# EAGLE design NAU7802 (EAGLE 9.6.2)
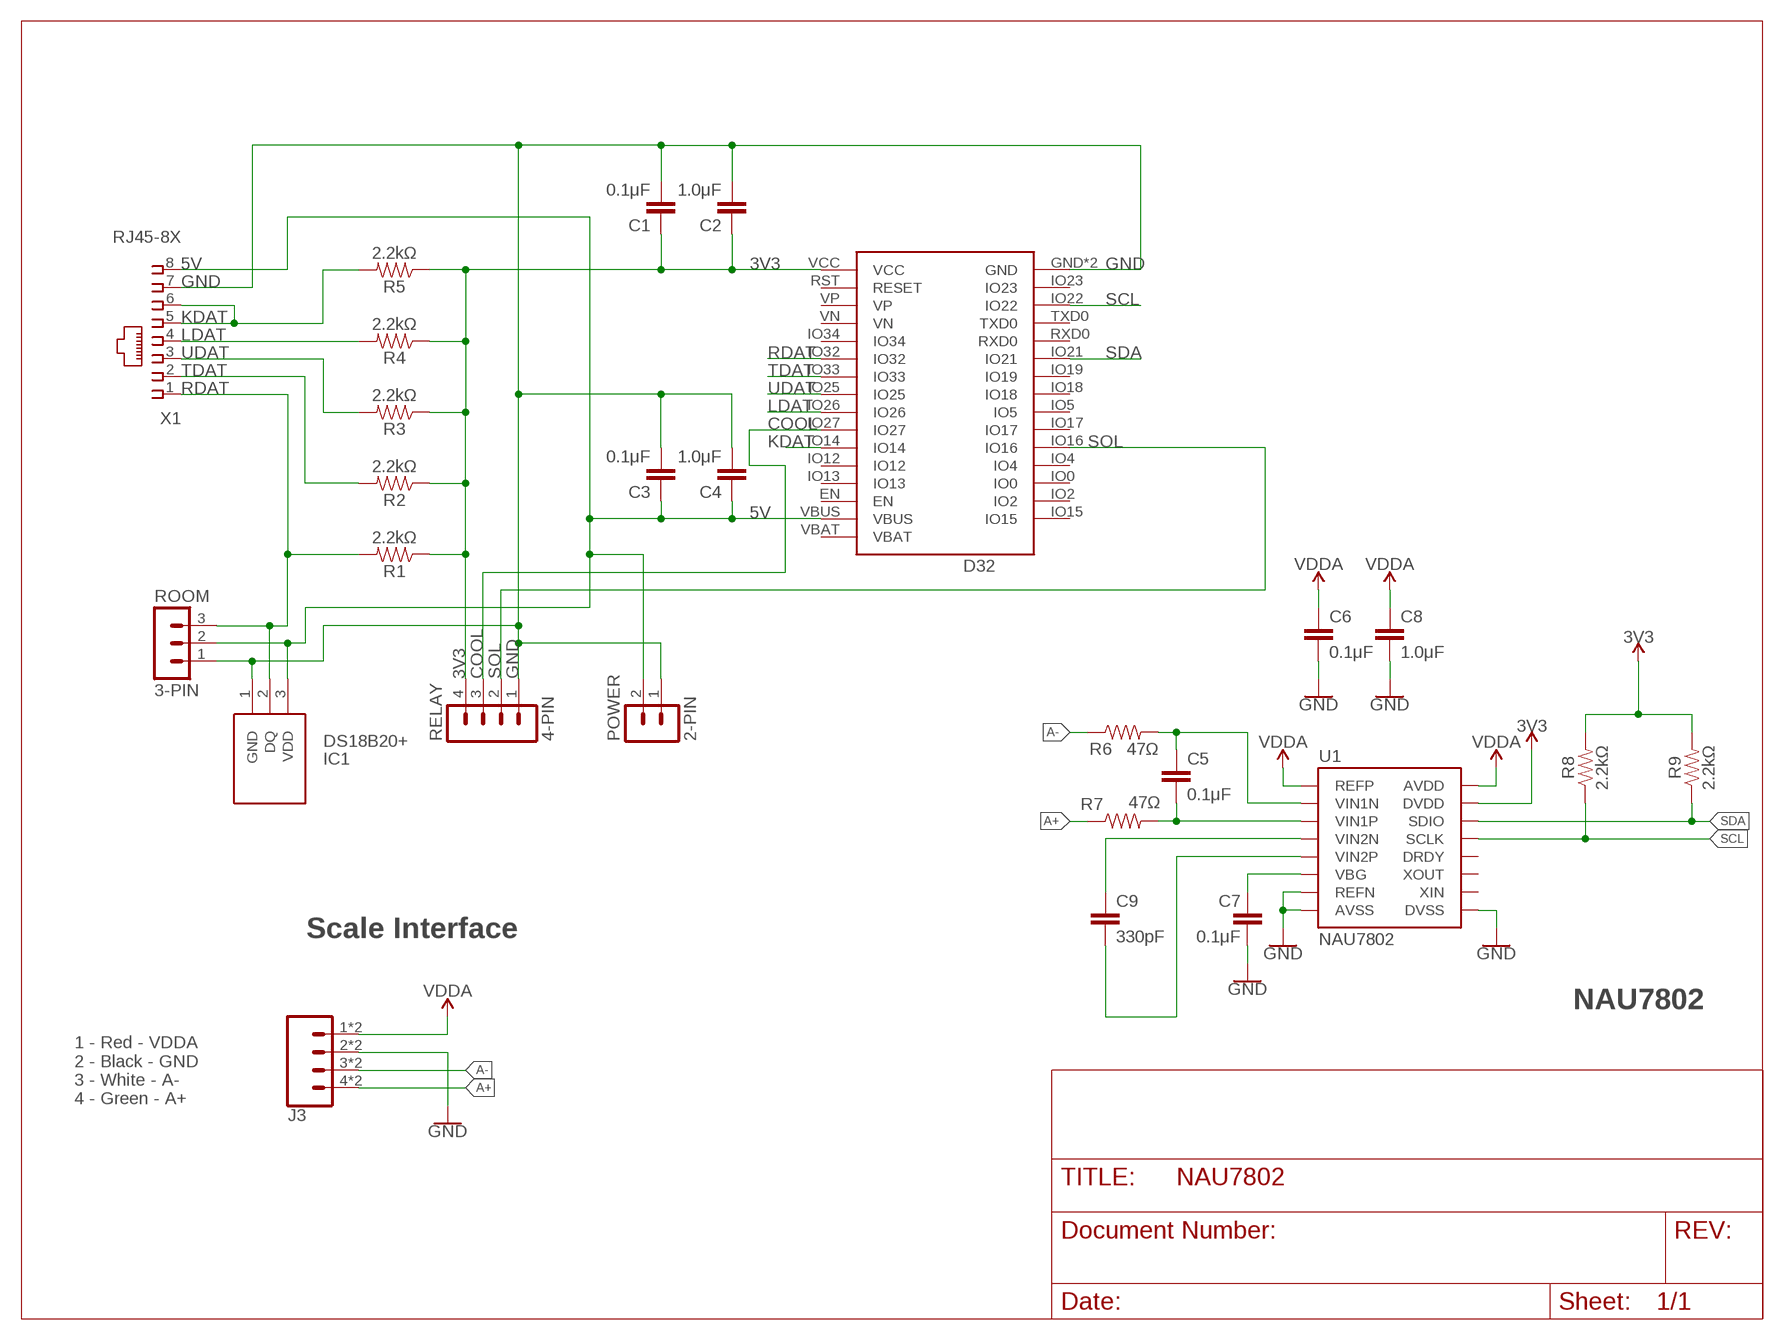
[diagram p0: schematic, sheet 1]

## Parts
C1  0.1μF  CAP_CERAMIC_2.54  [CAP_PTH-2.54]
C2  1.0μF  CAP_CERAMIC_2.54  [CAP_PTH-2.54]
C3  0.1μF  CAP_CERAMIC_2.54  [CAP_PTH-2.54]
C4  1.0μF  CAP_CERAMIC_2.54  [CAP_PTH-2.54]
C5  0.1μF  C-EU025-024X044  [C025-024X044]
C6  0.1μF  C-EU025-024X044  [C025-024X044]
C7  0.1μF  C-EU025-024X044  [C025-024X044]
C8  1.0μF  C-EU025-024X044  [C025-024X044]
C9  330pF  C-EU025-024X044  [C025-024X044]
D32  Lolin D32  WEMOS-D32D32_NO_BATT  [D32_NO_BATT]
IC1  DS18B20+  [TO-92]
J3  Spring Terminal  CONN_04SPRING  [1X04_SPRING_TERMINAL]
POWER  2-PIN  HDR-2  [HDR-2_VERT]
R1  2.2kΩ  RESISTORAXIAL-0.3  [AXIAL-0.3]
R2  2.2kΩ  RESISTORAXIAL-0.3  [AXIAL-0.3]
R3  2.2kΩ  RESISTORAXIAL-0.3  [AXIAL-0.3]
R4  2.2kΩ  RESISTORAXIAL-0.3  [AXIAL-0.3]
R5  2.2kΩ  RESISTORAXIAL-0.3  [AXIAL-0.3]
R6  47Ω  1KOHM-HORIZ-1/4W-5%  [AXIAL-0.3]
R7  47Ω  1KOHM-HORIZ-1/4W-5%  [AXIAL-0.3]
R8  2.2kΩ  1KOHM-HORIZ-1/4W-5%  [AXIAL-0.3]
R9  2.2kΩ  1KOHM-HORIZ-1/4W-5%  [AXIAL-0.3]
RELAY  4-PIN  MA04-1  [MA04-1]
ROOM  3-PIN  HDR-3  [HDR-3_VERT]
U1  NAU7802  NAU7802DIP16  [DIP16]
X1  RJ45-8X  [RJ45-NO-SHIELD]

## Nets
3V3 [3v]: C1.1 C2.1 D32.VCC R1.P$1 R2.P$1 R3.P$1 R4.P$1 R5.P$1 R8.P$2 R9.P$2 RELAY.4 U1.15(DVDD) ; supply symbol labelled 3.3V
5V [5v]: C3.1 C4.1 D32.VBUS IC1.3(VDD) POWER.2 ROOM.2 X1.8
A+: J3.4 J3.8 R7.P$1
A-: J3.3 J3.7 R6.P$1
B+: C9.2 U1.5(VIN2P)
COOL: D32.IO27 RELAY.3
GND: C1.2 C2.2 C3.2 C4.2 C6.2 C7.2 C8.2 D32.GND D32.GND2(GND) IC1.1(GND) J3.2 J3.6 POWER.1 RELAY.1 ROOM.1 U1.7(REFN) U1.8(AVSS) U1.9(DVSS) X1.7
KDAT: D32.IO14 R5.P$2 X1.5 X1.6
LDAT: D32.IO26 R4.P$2 X1.4
N$1: C9.1 U1.4(VIN2N)
N$11: C7.1 U1.6(VBG)
N$15: C5.2 R7.P$2 U1.3(VIN1P)
N$16: C5.1 R6.P$2 U1.2(VIN1N)
RDAT: D32.IO32 IC1.2(DQ) R1.P$2 ROOM.3 X1.1
SCL: D32.IO22 R8.P$1 U1.13(SCLK)
SDA: D32.IO21 R9.P$1 U1.14(SDIO)
SOL: D32.IO16 RELAY.2
TDAT: D32.IO33 R2.P$2 X1.2
UDAT: D32.IO25 R3.P$2 X1.3
VDDA: C6.1 C8.1 J3.1 J3.5 U1.1(REFP) U1.16(AVDD)
Unconnected: D32.EN D32.IO0 D32.IO2 D32.IO4 D32.IO5 D32.IO12 D32.IO13 D32.IO15 D32.IO17 D32.IO18 D32.IO19 D32.IO23 D32.IO34 D32.RST(RESET) D32.RXD0 D32.TXD0 D32.VBAT D32.VN D32.VP U1.10(XIN) U1.11(XOUT) U1.12(DRDY)

## Notes on the sheet
- Scale Interface
- NAU7802
- 1 - Red - VDDA
  2 - Black - GND
  3 - White - A-
  4 - Green - A+

## Library data of the parts
C1-C4 = Donnie:CAP_CERAMIC_2.54
C5-C9 = rcl:C-EU: CAPACITOR, European symbol; SPICEPREFIX: C
D32 = Donnie:WEMOS-D32: D32_REVERSE is a Reverse silkscreen for placing the Wemos D32 on the underside of the board D32_NO-KEEPOUT removes the keepout area beneath the antenna on the D32 and provides a note to avoid components and traces.
IC1 = SamacSys_Parts:DS18B20+: DS18B20 prog thermometer 1-Wire, TO92 Source: Datasheet <http://docs-emea.rs-online.com/webdocs/078b/0900766b8078b130.pdf>; ARROW_PART_NUMBER: DS18B20+; DESCRIPTION: DS18B20 prog thermometer 1-Wire, TO92; HEIGHT: mm; MANUFACTURER_NAME: Maxim Integrated; MANUFACTURER_PART_NUMBER: DS18B20+; MOUSER_PART_NUMBER: 700-DS18B20+; MOUSER_PRICE-STOCK: https://www.mouser.co.uk/ProductDetail/Maxim-Integrated/DS18B20%2b?qs=7H2Jq%252ByxpJKegCKabDbglA%3D%3D
J3 = SparkFun-Connectors:CONN_04: Multi connection point. Often used as Generic Header-pin footprint for 0.1 inch spaced/style header connections On any of the 0.1 inch spaced packages, you can populate with these: Break Away Headers - Straight <https://www.sparkfun.com/products/116> (PRT-00116) Break Away Male Headers - Right Angle <https://www.sparkfun.com/products/553> (PRT-00553) Female Headers <https://www.sparkfun.com/products/115> (PRT-00115) Break Away Headers - Machine Pin <https://www.sparkfun.com/products/117> (PRT-00117) Break Away Female Headers - Swiss Machine Pin <https://www.sparkfun.com/products/743> (PRT-00743) For SCREWTERMINALS and SPRING TERMINALS visit here: Screw Terimnals on SparkFun.com <https://www.sparkfun.com/search/results?term=Screw+Terminals> (5mm/3.5mm/2.54mm spacing) This device is also useful as a general connection point to wire up your design to another part of your project. Our various solder wires solder well into these plated through hole pads. Hook-Up Wire - Assortment (Stranded, 22 AWG) <https://www.sparkfun.com/products/11375> (PRT-11375) Hook-Up Wire - Assortment (Solid Core, 22 AWG) <https://www.sparkfun.com/products/11367> (PRT-11367) View the entire wire category on our website here <https://www.sparkfun.com/categories/141> Special notes: Molex polarized connector foot print use with SKU : PRT-08231 with associated crimp pins and housings. 1MM SMD Version SKU: PRT-10208; SF_ID: PRT-08075
POWER = Donnie:HDR-2
R1-R5 = SparkFun-Resistors:RESISTOR: Generic Resistor Package
R6-R9 = SparkFun-Resistors:1KOHM: 1kΩ resistor A resistor is a passive two-terminal electrical component that implements electrical resistance as a circuit element. Resistors act to reduce current flow, and, at the same time, act to lower voltage levels within circuits. - Wikipedia; PROD_ID: RES-08380; VALUE: 1k
RELAY = Donnie:MA04-1: PIN HEADER; OC_FARNELL: unknown; OC_NEWARK: unknown
ROOM = Donnie:HDR-3: PIN HEADER
U1 = SparkFun-IC-Conversion:NAU7802: 24-bit load cell conversion IC with I2C interface in SOIC-16 package. Similar to HX711 but with true I2C interface.
X1 = con-tycoelectronics:RJ45: CORCOM Modular RJ Jacks No Shield Source: www.tycoelectronics.com .. ENG_DS_1654001_1099_RJ_L_0507.pdf; MPN: RJ45-8X; OC_FARNELL: unknown; OC_NEWARK: 16R6101

## Net classes
0 default: width 0.305 mm, clearance 0.305 mm
1 5v: width 0.406 mm, clearance 0.406 mm
2 3v: width 0.406 mm, clearance 0.406 mm

## Board
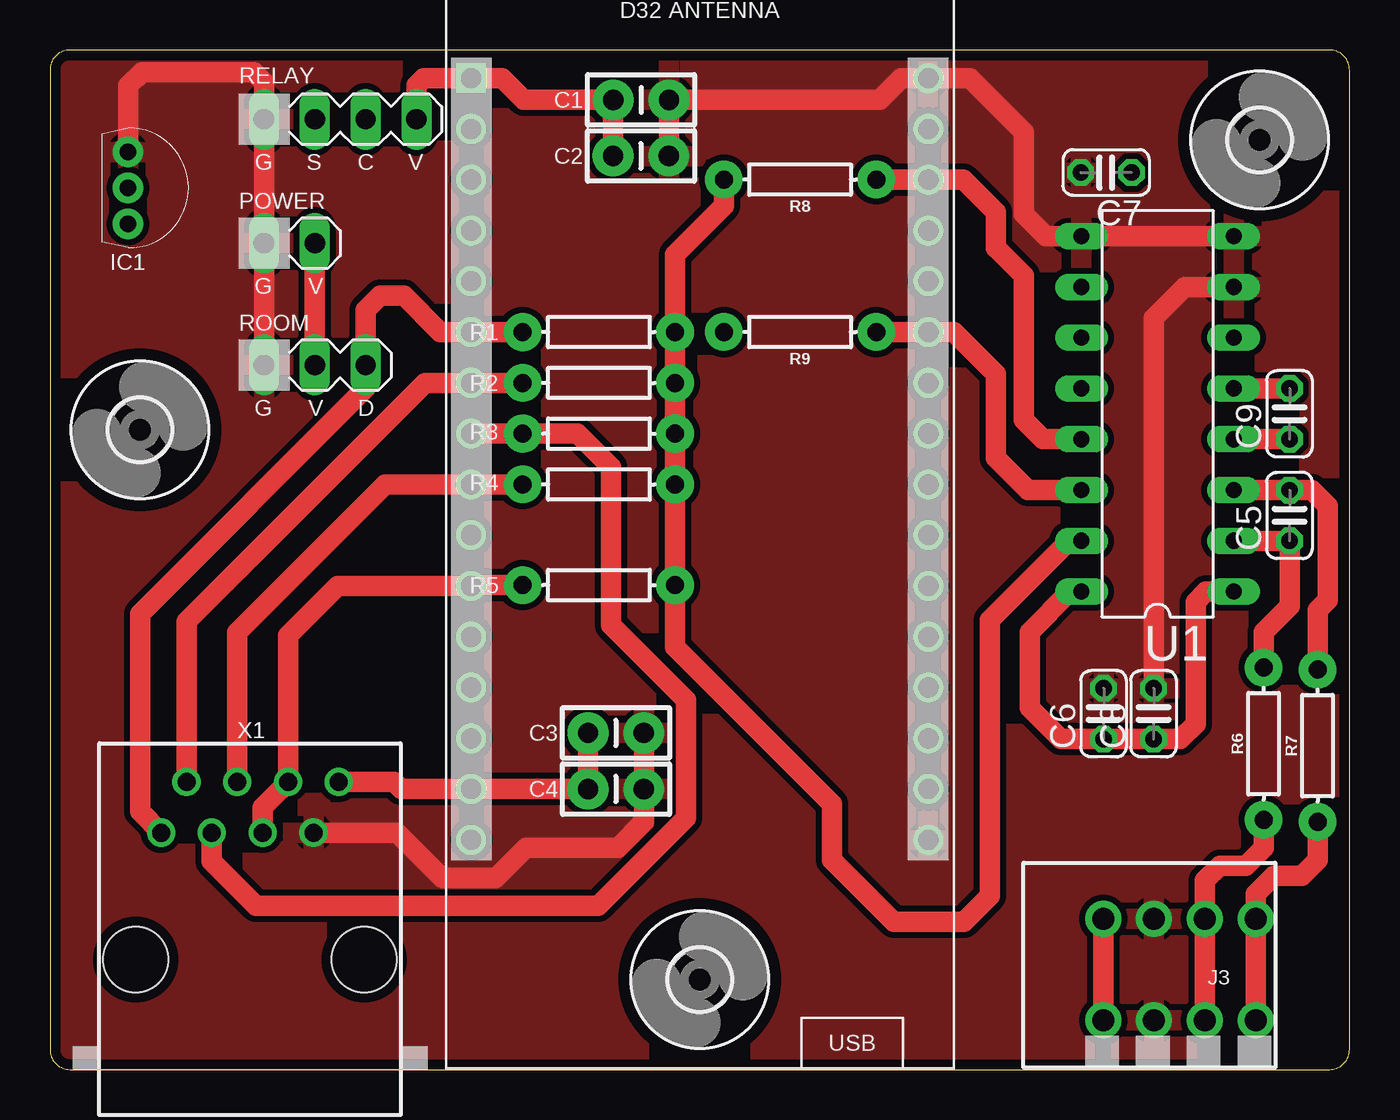
[diagram p1: board, top side]
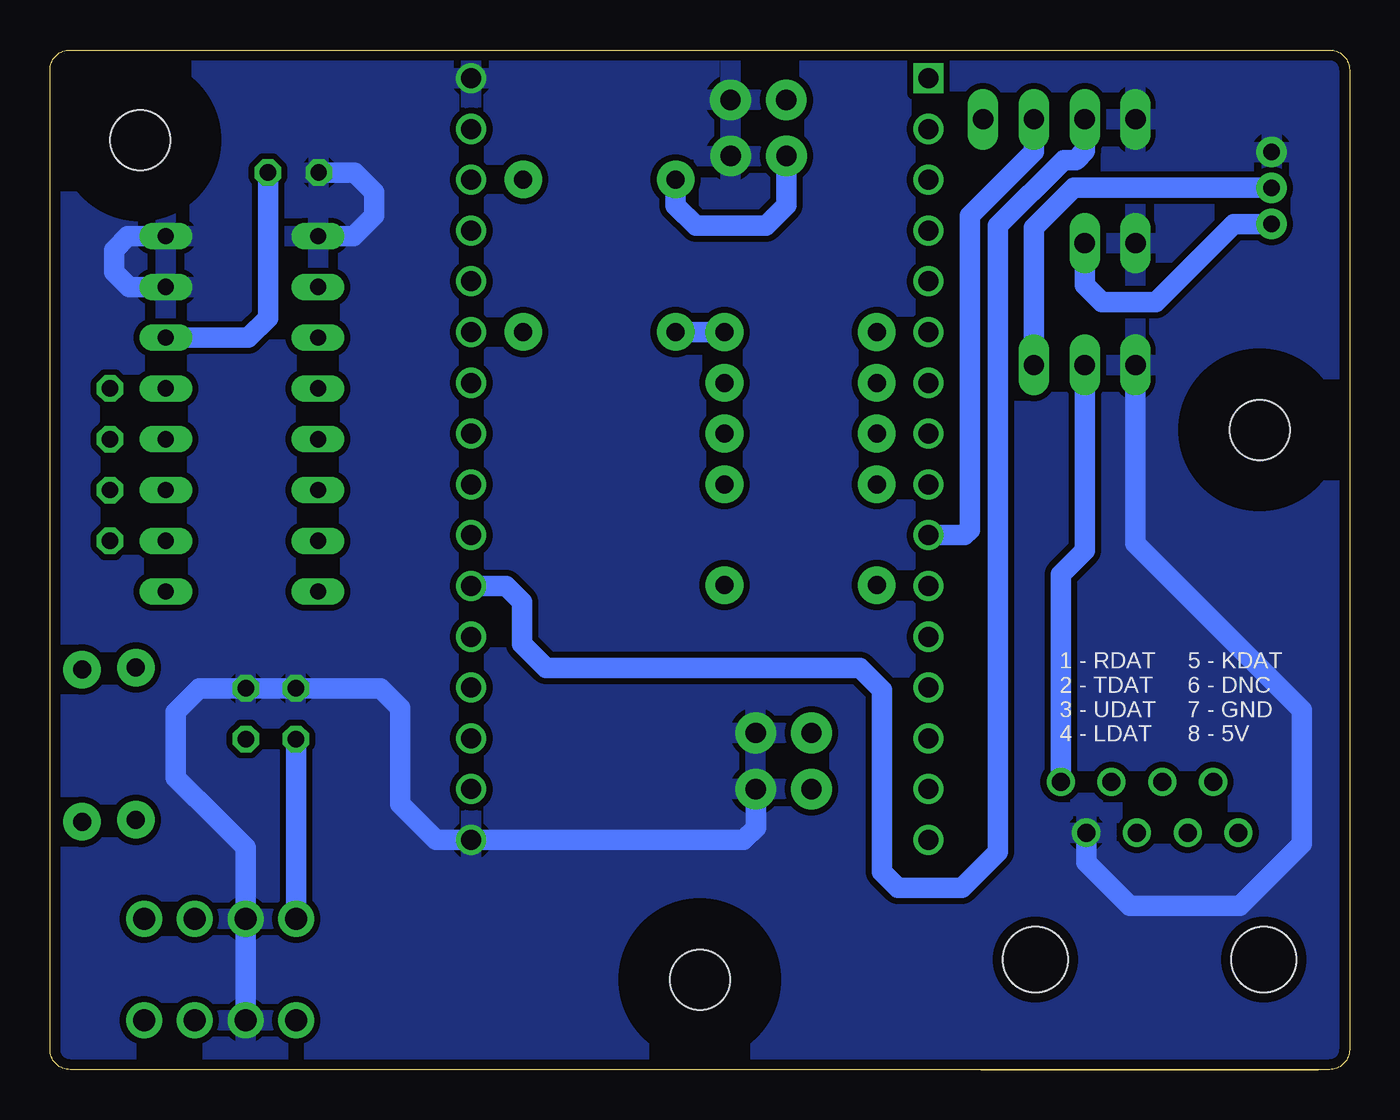
[diagram p2: board, bottom side, seen from below]

Size 65 x 51.01 mm. Coordinates in mm from the lower left corner, seen from the top.
Outline: 1,0.01 64,0.01 arc90 65,1.01 65,50.01 arc90 64,51.01 1,51.01 arc90 0,50.01 0,1.01 arc90 1,0.01
Copper layers (1*16): Top 0.035mm / dielectric 1.5mm / Bottom 0.035mm
Design rules "default *": minimum track width 6mil, minimum drill 0.35mm, track to track 6mil, track to pad 6mil, pad to pad 6mil, via to via 6mil, smd to smd 6mil, copper to edge 20mil, drill to drill 6mil, minimum pad ring 10mil, minimum via ring 8mil, stop-mask expansion 4mil, vias tented up to drill 20mil, thermal gap 10mil

### Footprints (pad centres in the part's own frame; a part is rotated, then mirrored left to right if it is on the bottom)
CAP_PTH-2.54 = drill 1.016 pad 2.032: 1 -1.397,0; 2 1.397,0
C025-024X044 = drill 0.813 octagon: 1 -1.27,0; 2 1.27,0
D32_NO_BATT = drill 1: EN -11.43,-12.7; GND 11.43,20.32; GND2 11.43,-17.78; IO0 11.43,-10.16; IO2 11.43,-12.7; IO4 11.43,-7.62; IO5 11.43,0; IO12 -11.43,-7.62; IO13 -11.43,-10.16; IO14 -11.43,-5.08; IO15 11.43,-15.24; IO16 11.43,-5.08; IO17 11.43,-2.54; IO18 11.43,2.54; IO19 11.43,5.08; IO21 11.43,7.62; IO22 11.43,15.24; IO23 11.43,17.78; IO25 -11.43,2.54; IO26 -11.43,0; IO27 -11.43,-2.54; IO32 -11.43,7.62; IO33 -11.43,5.08; IO34 -11.43,10.16; RST -11.43,17.78; RXD0 11.43,10.16; TXD0 11.43,12.7; VBAT -11.43,-17.78; VBUS -11.43,-15.24; VN -11.43,12.7; VP -11.43,15.24 | drill 1 square: VCC -11.43,20.32
TO-92 = drill 0.81 pad 1.51: 1 0,-1.8; 2 0,0; 3 0,1.8
1X04_SPRING_TERMINAL = drill 1.1 pad 1.8: 1 7.62,2.54; 2 5.08,2.54; 3 2.54,2.54; 4 0,2.54; 5 7.62,-2.54; 6 5.08,-2.54; 7 2.54,-2.54; 8 0,-2.54
HDR-2_VERT = drill 1.016 long: 1 0,0; 2 2.54,0
AXIAL-0.3 = drill 0.9 pad 1.88: P$1 -3.81,0; P$2 3.81,0
MA04-1 = drill 1.016 long: 1 -3.81,0; 2 -1.27,0; 3 1.27,0; 4 3.81,0
HDR-3_VERT = drill 1.016 long: 1 0,0; 2 2.54,0; 3 5.08,0
DIP16 = drill 0.813 long: 1 -8.89,-3.81; 2 -6.35,-3.81; 3 -3.81,-3.81; 4 -1.27,-3.81; 5 1.27,-3.81; 6 3.81,-3.81; 7 6.35,-3.81; 8 8.89,-3.81; 9 8.89,3.81; 10 6.35,3.81; 11 3.81,3.81; 12 1.27,3.81; 13 -1.27,3.81; 14 -3.81,3.81; 15 -6.35,3.81; 16 -8.89,3.81
3,0 = hole 3: 0,0
RJ45-NO-SHIELD = drill 0.9 pad 1.4: 1 -4.445,6.35; 2 -3.175,8.89; 3 -1.905,6.35; 4 -0.635,8.89; 5 0.635,6.35; 6 1.905,8.89; 7 3.175,6.35; 8 4.445,8.89 | hole 3.251: -5.715,0; 5.715,0

### Placement (x,y rotation side)
C1  29.57,48.51 0 top
C2  29.56,45.71 0 top
C3  28.31,16.85 0 top
C4  28.31,14.04 0 top
C5  62,27.73 90 top
C6  52.7,17.81 90 top
C7  52.83,44.88 180 top
C8  55.2,17.81 90 top
C9  62,32.81 90 top
D32  32.5,29.28 0 top
IC1  3.9,44.11 180 top
J3  60.3,5.01 180 top
POWER  10.71,41.35 0 top
R1  27.45,36.9 180 top
R2  27.45,34.36 180 top
R3  27.45,31.82 180 top
R4  27.45,29.28 180 top
R5  27.45,24.24 180 top
R6  60.7,16.31 90 top
R7  63.4,16.21 90 top
R8  37.52,44.53 180 top
R9  37.52,36.9 180 top
RELAY  14.52,47.55 0 top
ROOM  10.71,35.25 0 top
U1  55.4,32.81 90 top
U$1  [3,0]  4.5,32.01 0 top
U$2  [3,0]  32.5,4.51 0 top
U$3  [3,0]  60.5,46.51 0 top
X1  10,5.51 0 top

### Tracks (layer width: path | path; a pad name or v marks a point on that pad's centre or on a via)
3V3
  Top 1.016: C2.1 C1.1 23.7,48.51 22.61,49.6 D32.VCC 18.69,49.6 18.33,49.24 RELAY.4 | R8.P$2 33.71,43.22 31.26,40.77 R1.P$1 R2.P$1 R3.P$1 R4.P$1 R5.P$1 31.26,21.15 39.1,13.31 39.1,10.51 42.2,7.41 45.7,7.41 47,8.71 47,22.51 50.95,26.46 U1.15
  Bottom 1.016: C2.1 28.16,43.25 29.2,42.21 32.7,42.21 33.71,43.22 R8.P$2 | R9.P$2 R1.P$1
5V
  Top 1.016: X1.8 17.21,14.4 17.57,14.04 D32.VBUS C4.1 C3.1 | ROOM.2 POWER.2
  Bottom 1.016: X1.8 14.45,24.77 13.25,25.96 ROOM.2 | POWER.2 13.25,39.26 12.4,38.41 9.7,38.41 5.8,42.31 IC1.3
A+
  Top 1.016: R7.P$1 63.4,10.51 62.6,9.71 61.2,9.71 60.3,8.81 J3.8 J3.4
A-
  Top 1.016: R6.P$1 60.7,11.11 59.8,10.21 58.5,10.21 57.76,9.47 J3.7 J3.3
B+
  Top 1.016: U1.5 C9.2
COOL
  Bottom 1.016: D32.IO27 19.27,26.74 19,27.01 19,42.61 19,42.71 15.79,45.92 RELAY.3
GND
  Top 1.016: C2.2 C1.2 41.5,48.51 42.59,49.6 D32.GND 46.01,49.6 48.7,46.91 48.7,42.8 49.8,41.7 U1.9 U1.8 | X1.7 17.35,11.86 19.6,9.61 22.3,9.61 23.8,11.11 28.4,11.11 29.71,12.42 C4.2 C3.2 | ROOM.1 POWER.1 RELAY.1 10.71,49.4 10.2,49.91 4.6,49.91 3.9,49.21 IC1.1 | U1.7 56.75,39.16 55.2,37.61 C8.2
  Bottom 1.016: X1.7 13.18,10.39 11,8.21 5.49,8.21 2.4,11.3 2.4,18.01 10.71,26.32 ROOM.1 | C4.2 29.7,12.11 30.31,11.5 D32.GND2 45.69,11.5 47.5,13.31 47.5,18.11 48.37,18.98 48.47,19.08 C6.2 C8.2 57.53,19.08 57.63,18.98 58.7,17.91 58.7,14.61 56.62,12.53 55.22,11.13 J3.6 J3.2 | U1.9 49.81,41.7 48.8,42.71 48.8,43.91 49.77,44.88 C7.2 | U1.8 61.11,41.7 61.8,41.01 61.8,39.91 61.05,39.16 U1.7
  pour Top: 65.4,51.21 65.4,-0.09 -0.2,-0.09 -0.2,51.21
  pour Bottom: -0.2,51.31 -0.2,-0.29 65.2,-0.29 65.2,51.31
KDAT
  Top 1.016: X1.5 10.63,13.13 X1.6 11.9,21.72 14.39,24.2 D32.IO14 21.11,24.24 R5.P$2
LDAT
  Top 1.016: X1.4 9.37,21.88 16.77,29.28 20.9,29.28 | 20.9,29.28 D32.IO26 | 20.9,29.28 R4.P$2
N$1
  Top 1.016: U1.4 C9.1
N$11
  Bottom 1.016: U1.6 55.09,36.62 54.1,37.61 C7.1
N$15
  Top 1.016: R7.P$2 63.4,23.01 63.9,23.51 63.9,28.21 63.12,29 C5.2 U1.3
N$16
  Top 1.016: R6.P$2 60.7,21.91 62,23.21 C5.1 U1.2
RDAT
  Top 1.016: X1.1 4.5,12.92 4.5,22.81 15.59,33.9 15.79,34.1 ROOM.3 15.79,38 16.5,38.71 17.7,38.71 19.51,36.9 D32.IO32 R1.P$2
  Bottom 1.016: ROOM.3 15.79,42.1 15.8,42.11 13.8,44.11 IC1.2
SCL
  Top 1.016: R8.P$1 D32.IO22 45.69,44.52 47.3,42.91 47.3,41.11 48.7,39.71 48.7,32.51 49.67,31.54 U1.13
SDA
  Top 1.016: R9.P$1 D32.IO21 45.21,36.9 47.3,34.81 47.3,30.61 48.91,29 U1.14
SOL
  Bottom 1.016: D32.IO16 42.19,24.2 41.4,23.41 41.4,21.31 40.2,20.11 24.5,20.11 23.4,19.01 23.4,9.91 22.6,9.11 19.4,9.11 17.6,10.91 17.6,40.61 17.6,41.41 17.6,42.21 14.3,45.51 13.7,45.51 13.25,45.96 RELAY.2
TDAT
  Top 1.016: X1.2 6.83,22.44 18.75,34.36 D32.IO33 21.18,34.36 R2.P$2
UDAT
  Top 1.016: X1.3 8.1,10.42 10.3,8.21 27.4,8.21 31.8,12.61 31.8,18.51 28.06,22.25 28.06,30.15 26.39,31.82 R3.P$2 D32.IO25
VDDA
  Top 1.016: U1.16 51.01,23.92 49,21.91 49,18.11 50.57,16.54 C6.1 C8.1 56.53,16.54 57.3,17.31 57.3,23.41 57.81,23.92 U1.1 | J3.1 J3.5
  Bottom 1.016: J3.5 52.68,16.52 C6.1

### Text on the board
tNames: G | S | C | V | G | V | G | V | D
bNames: 5 - KDAT / 6 - DNC / 7 - GND / 8 - 5V | 1 - RDAT / 2 - TDAT / 3 - UDAT / 4 - LDAT